# Altium schematic sheet Interface_exp.SchDoc: Array and Charger Interface
size A; SheetNumber: 3; SheetTotal: 6
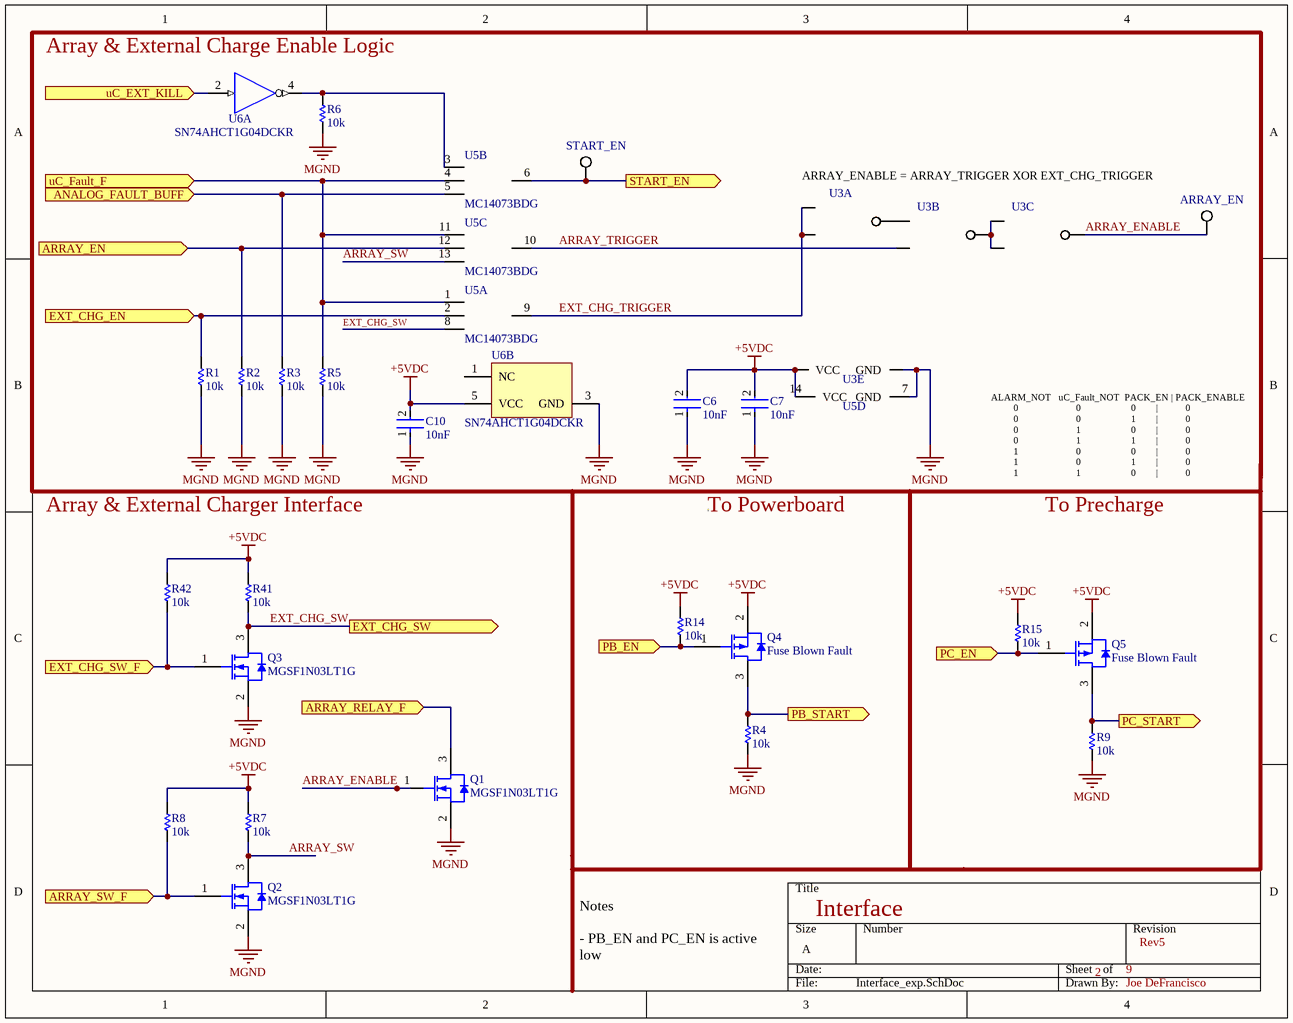
[diagram p0: Interface_exp.SchDoc]

## Parts
ARRAY_EN  Test Point  [Test Point]  (value not drawn)
C6  Capacitance: 10nF  [FP-CGA3E-0_3-0_1-IPC_A]  (hidden comment: CGA3E2X8R2A103K080AD)
C7  Capacitance: 10nF  [FP-CGA3E-0_3-0_1-IPC_A]  (hidden comment: CGA3E2X8R2A103K080AD)
C10  Capacitance: 10nF  [FP-CGA3E-0_3-0_1-IPC_A]  (hidden comment: CGA3E2X8R2A103K080AD)
Q1  MGSF1N03LT1G  [ONSC-SOT-23-3-318-08_V]
Q2  MGSF1N03LT1G  [ONSC-SOT-23-3-318-08_V]
Q3  MGSF1N03LT1G  [ONSC-SOT-23-3-318-08_V]
Q4  Fuse Blown Fault  [INTR-SOT-23-3_V]
Q5  Fuse Blown Fault  [INTR-SOT-23-3_V]
R1  SchematicInformation: 10k  [R_0603]  (hidden comment: RES_10k_1%_0603)
R2  SchematicInformation: 10k  [R_0603]  (hidden comment: RES_10k_1%_0603)
R3  SchematicInformation: 10k  [R_0603]  (hidden comment: RES_10k_1%_0603)
R4  SchematicInformation: 10k  [R_0603]  (hidden comment: RES_10k_1%_0603)
R5  SchematicInformation: 10k  [R_0603]  (hidden comment: RES_10k_1%_0603)
R6  SchematicInformation: 10k  [R_0603]  (hidden comment: RES_10k_1%_0603)
R7  SchematicInformation: 10k  [R_0603]  (hidden comment: RES_10k_1%_0603)
R8  SchematicInformation: 10k  [R_0603]  (hidden comment: RES_10k_1%_0603)
R9  SchematicInformation: 10k  [R_0603]  (hidden comment: RES_10k_1%_0603)
R14  SchematicInformation: 10k  [R_0603]  (hidden comment: RES_10k_1%_0603)
R15  SchematicInformation: 10k  [R_0603]  (hidden comment: RES_10k_1%_0603)
R41  SchematicInformation: 10k  [R_0603]  (hidden comment: RES_10k_1%_0603)
R42  SchematicInformation: 10k  [R_0603]  (hidden comment: RES_10k_1%_0603)
START_EN  Test Point  [Test Point]  (value not drawn)
U3  Quad NAND Gate - 2 Input  [SO14]  (value not drawn)  (parts A,B,C,E of 5)
U5  MC14073BDG  [SO14]  (parts A,B,C,D of 4)
U6  SN74AHCT1G04DCKR  [DCK0005A_L]  (parts A,B of 2)

## Ports
ANALOG_FAULT_BUFF (in), ARRAY_EN (in), ARRAY_RELAY_F (in), ARRAY_SW_F (in), EXT_CHG_EN (in), EXT_CHG_SW (out), EXT_CHG_SW_F (in), PB_EN (in), PB_START (out), PC_EN (in), PC_START (out), START_EN (out), uC_EXT_KILL (in), uC_Fault_F (in)

## Nets
+5VDC: C6.2 C7.2 C10.2 Q4.2(SOURCE) Q5.2(SOURCE) R7.1 R8.1 R14.1 R15.1 R41.1 R42.1 U3.14(VCC) U5.14(VCC) U6.5(VCC)
MGND: C6.1 C7.1 C10.1 Q1.2(S) Q2.2(S) Q3.2(S) R1.2 R2.2 R3.2 R4.2 R5.2 R6.2 R9.2 U3.7(GND) U5.7(GND) U6.3(GND)
ANALOG_FAULT_BUFF: R3.1 U5.5 ; port ANALOG_FAULT_BUFF
ARRAY_EN: R2.1 U5.12 ; port ARRAY_EN
ARRAY_ENABLE: ARRAY_EN.1 Q1.1(G) U3.8
ARRAY_RELAY_F: Q1.3(D) ; port ARRAY_RELAY_F
ARRAY_SW: Q2.3(D) R7.2 U5.13
ARRAY_SW_F: Q2.1(G) R8.2 ; port ARRAY_SW_F
ARRAY_TRIGGER: U3.5 U5.10
EXT_CHG_EN: R1.1 U5.2 ; port EXT_CHG_EN
EXT_CHG_SW: Q3.3(D) R41.2 U5.8 ; port EXT_CHG_SW
EXT_CHG_SW_F: Q3.1(G) R42.2 ; port EXT_CHG_SW_F
EXT_CHG_TRIGGER: U3.1 U3.2 U5.9
PB_EN: Q4.1(GATE) R14.2 ; port PB_EN
PB_START: Q4.3(DRAIN) R4.1 ; port PB_START
PC_EN: Q5.1(GATE) R15.2 ; port PC_EN
PC_START: Q5.3(DRAIN) R9.1 ; port PC_START
START_EN: START_EN.1 U5.6 ; port START_EN
uC_EXT_KILL: U6.2(A) ; port uC_EXT_KILL
uC_Fault_F: R5.1 U5.1 U5.4 U5.11 ; port uC_Fault_F
NetR6_1: R6.1 U5.3 U6.4(Y)
NetU3_3: U3.3 U3.4
NetU3_6: U3.6 U3.9 U3.10

Not connected (* = marked no-connect by the designer): U6 1(NC)

## Notes on the sheet
- Array & External Charge Enable Logic
- (near U3) ARRAY_ENABLE = ARRAY_TRIGGER XOR EXT_CHG_TRIGGER
- ALARM_NOT   uC_Fault_NOT  PACK_EN | PACK_ENABLE
  0                       0                    0        |           0
  0                       0                    1        |           0
  0                       1                    0        |           0
  0                       1                    1        |           0
  1                       0                    0        |           0
  1                       0                    1        |           0
  1                       1                    0        |           0
  1                       1                    1        |           1
- Array & External Charger Interface
- To Powerboard
- To Precharge
- Interface
- 2
- 9
- Rev5
- Notes
  - PB_EN and PC_EN is active low
- Joe DeFrancisco

## Library data of the parts
C6 C7 C10 = CMP-08246-000769-1: Cap Ceramic 10nF 100V X8R 10% Pad SMD 0603 +150°C Automotive T/R; Mount: Surface Mount; Voltage Rating (DC): 100V; Termination: SMD/SMT; Dielectric: X8R; Case/Package: 0603; Ratings: AEC-Q200; Voltage Rating: 100V; Packaging: Tape and Reel; Thickness: 0.035inch; Composition: Ceramic; Max Operating Temperature: 150°C; Width: 0.031inch; Height: 0.8mm; Weight: 7.1E-05oz; Depth: 0.8mm; Min Operating Temperature: -55°C; Length: 1.6mm; Case Code (Metric): 1608; Tolerance: 10%; Package Quantity: 4000; Case Code (Imperial): 0603
Q1-Q3 = CMP-1058-00778-1: Power MOSFET, 30 V, 2.1 A, Single N-Channel, 3-Pin SOT-23, Pb-Free, Tape and Reel; Manufacturer: On Semiconductor; VGS(th) Max (V): 2.4; Channel Polarity: N Channel; Ciss Typ (pF): 140; Crss Typ (pF): 40; Coss Typ (pF): 100; V(BR)DSS Min (V): 30; ID Max (A): 2.1; VGS Max (V): 20; ComponentLink1Description: Manufacturer URL; PartNumber: MGSF1N03LT1G; Packing: Tape and Reel; DatasheetVersion: Rev. 10; ComponentLink1URL: http://www.onsemi.com/; Mounting Technology: Surface Mount; PackageVersion: Rev. AP, 11/2009; PackageDescription: 3-Pin Small Outline Transistor, Body 2.92 x 1.3 mm, Pitch 0.95 mm; Package Type: SOT-23-3; ComponentLink3URL: http://www.onsemi.cn/pub_link/Collateral/318-08.PDF; RoHS: Pb-Free; ComponentLink3Description: Package Specification; ComponentLink2Description: Datasheet; Configuration: Single; PackageReference: SOT-23-3-318-08; ComponentLink2URL: http://www.onsemi.cn/pub_link/Collateral/MGSF1N03LT1-D.PDF
Q4 Q5 = CMP-2000-04987-1: HEXFET(R) Power P-Channel MOSFET, -20 V, -3.7 A, -55 to 150 degC, 3-Pin SOT-23, RoHS, Tape and Reel; Manufacturer: International Rectifier; Drain-to-Source Voltage [Vdss]: 20V; Rated Power Dissipation: 1.3W; Qg Gate Charge: 8nC; Drain-Source On Resistance-Max: 0.065O; Channel Type: P-Channel; Package Reference: SOT-23-3; Manufacturer URL: http://internationalrectifier.com/; Datasheet URL: http://datasheet.octopart.com/IRLML6402TRPBF-International-Rectifier-datasheet-93882.pdf; Datasheet Version: Feb-05; Package Description: 3-Pin Small Outline Transistor, Body 2.92 x 1.3 mm, Pitch 0.95 mm
R1-R9 R14 R15 R41 R42 = RES_10k_1%_0603: Manufacturer Part Number: RC0603FR-0710KL; Manufacturer: Yageo; DigiKey Part Number: 311-10.0KHRCT-ND
U3 = NAND Quad 2 Input - 74AC00SCX: Quad NAND Gate - 2 Input 74AC00SCX; Digikey: http://www.digikey.com/product-detail/en/fairchild-semiconductor/74AC00SCX/74AC00SCXCT-ND/1626130; Datasheet: https://www.fairchildsemi.com/datasheets/74/74ACT00.pdf; Supplier 1: Digikey; Supplier Part Number 1: 74AC00SCXCT-ND
U5 = MC14073BDG: Triple 3-Input AND; ComponentLink1Description: Datasheet; ComponentLink1URL: http://www.onsemi.com/pub_link/Collateral/MC14001B-D.PDF; Drawn By: Aaron Mills; Drawing Date: Jan. 17, 2011
U6 = CMP-0859-00358-3: Single Inverter Gate, DCK0005A, LARGE T&R; Manufacturer: Texas Instruments; VCC(Min)(V): 2; Rating: Catalog; tpd @ Nom Voltage(Max)(ns): 7.5; F @ Nom Voltage(Max)(Mhz): 75; Schmitt Trigger: No; Output Type: CMOS; Logic: Inverting; VCC(Max)(V): 5.5; Sub-Family: Inverting Buffer/Driver; Bits(#): 1; Technology Family: AHCT; Voltage(Nom)(V): 5; Output Drive (IOL/IOH)(Max)(mA): 8/-8; ICC @ Nom Voltage(Max)(mA): 0.01; Input Type: CMOS; DatasheetVersion: SCLS319P; Operating Temperature Range(C): -40 to 125; Generic Part Number: SN74AHCT1G04; PackageReference: DCK0005A; 3-State Output: No